# Altium project epsv2.PrjPCB
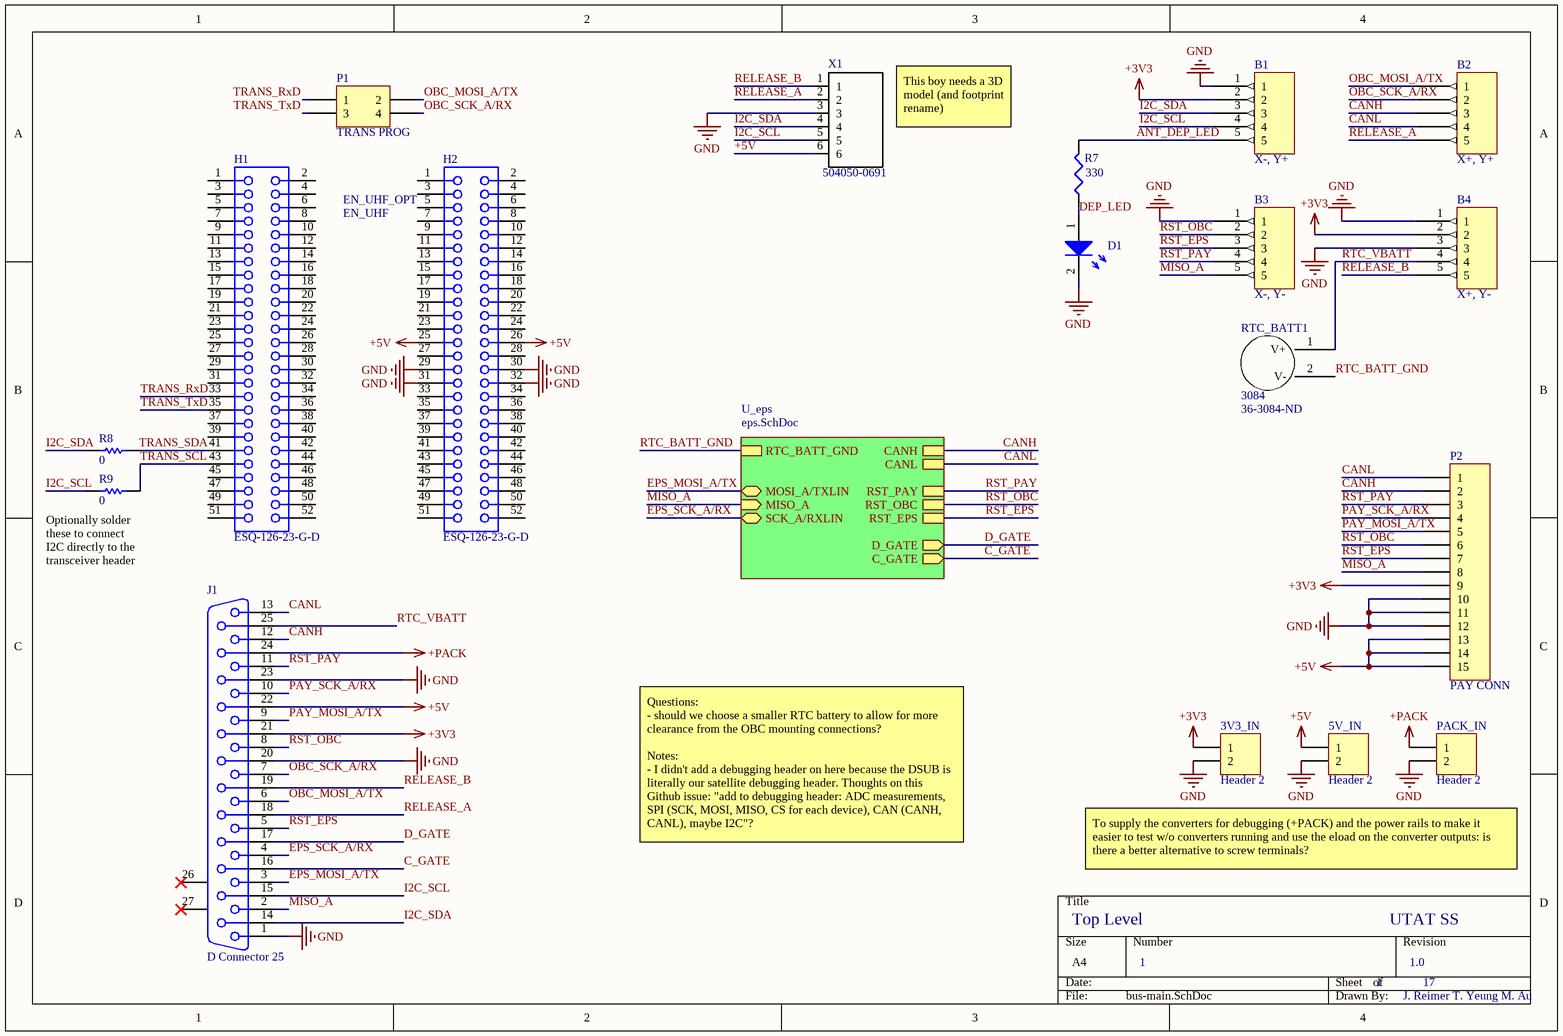
[diagram p0: bus-main.SchDoc]
9 sheets, 132 parts. Net scope: hierarchical (ports join the sheet entries above them; power ports are global).
Board file: eps.PcbDoc
Sheets:
  bus-main.SchDoc
  eps_6.0.SchDoc
    U_eps_digital = eps_digital.SchDoc
    U_eps_bb11 = eps_bb1.SchDoc
    U_eps_bb12 = eps_bb1.SchDoc
    U_eps_pv = eps_pv.SchDoc
    U_eps_bt11 = eps_bt1.SchDoc
    U_eps_bt12 = eps_bt1.SchDoc
    U_eps_batt = eps_batt.SchDoc
    Designator = bt_current_monitor.SchDoc
  eps_flash.SchDoc

## Sheet bus-main.SchDoc: Top Level
size A4; DrawnBy: J. Reimer T. Yeung M. Au; Organization: UTAT SS; DocumentNumber: 1; Revision: 1.0; SheetNumber: 1; SheetTotal: 17

### Parts
(Parts that share a designator on the sheet are numbered #1, #2 ... from top to bottom, then left to right.)
3V3_IN  Header 2  [CON2_SCREW_5.00MM_691102710002]
5V_IN  Header 2  [CON2_SCREW_5.00MM_691102710002]
B1  X-, Y+  [70AAJ-5-M0-ND]
B2  X+, Y+  [70AAJ-5-M0-ND]
B3  X-, Y-  [70AAJ-5-M0-ND]
B4  X+, Y-  [70AAJ-5-M0-ND]
D1#1  (no value)  [LED0603]
H1  ESQ-126-23-G-D  [SSW-126-01-G-D]
H2  ESQ-126-23-G-D  [SSW-126-01-G-D]
J1  D Connector 25  [Mini DSub Connector]
P1  TRANS PROG  [HDR2X2]
P2  PAY CONN  [DF13A-15P-1.25H(21)]
PACK_IN  Header 2  [CON2_SCREW_5.00MM_691102710002]
R7#1  330  [RES0402R]
R8  0  [1608[0603]]
R9#1  0  [1608[0603]]
RTC_BATT1  3084  Supplier Part Number 1: 36-3084-ND  [3084]
X1  504050-0691  [MOLEX_504050-0691]

### Sub-sheets
U_eps = eps.SchDoc (file not in this document): RST_PAY, RST_OBC, RST_EPS, SCK_A/RXLIN (bidir), MOSI_A/TXLIN (bidir), MISO_A (in), CANL, CANH, RTC_BATT_GND, D_GATE (out), C_GATE (out)

### Nets
+3V3: 3V3_IN.1 B1.2 B4.2 J1.21 P2.9
+5V: 5V_IN.1 H2.25 H2.26 J1.22 P2.13 P2.14 P2.15 X1.6
+PACK: J1.24 PACK_IN.1
GND: 3V3_IN.2 5V_IN.2 B1.1 B3.1 B4.1 B4.3 D1#1.2 H2.29 H2.30 H2.31 H2.32 J1.1 J1.20 J1.23 P2.10 P2.11 P2.12 PACK_IN.2 X1.3
ANT_DEP_LED: B1.5 R7#1.2
C_GATE: J1.16 ; sheet U_eps/C_GATE
CANH: B2.3 J1.12 P2.2 ; sheet U_eps/CANH
CANL: B2.4 J1.13 P2.1 ; sheet U_eps/CANL
D_GATE: J1.17 ; sheet U_eps/D_GATE
DEP_LED: D1#1.1 R7#1.1
EPS_MOSI_A/TX: J1.3 ; sheet U_eps/MOSI_A/TXLIN
EPS_SCK_A/RX: J1.4 ; sheet U_eps/SCK_A/RXLIN
I2C_SCL: B1.4 J1.15 R9#1.1 X1.5
I2C_SDA: B1.3 J1.14 R8.1 X1.4
MISO_A: B3.5 J1.2 P2.8 ; sheet U_eps/MISO_A
OBC_MOSI_A/TX: B2.1 J1.6 P1.2
OBC_SCK_A/RX: B2.2 J1.7 P1.4
PAY_MOSI_A/TX: J1.9 P2.5
PAY_SCK_A/RX: J1.10 P2.4
RELEASE_A: B2.5 J1.18 X1.2
RELEASE_B: B4.5 J1.19 X1.1
RST_EPS: B3.3 J1.5 P2.7 ; sheet U_eps/RST_EPS
RST_OBC: B3.2 J1.8 P2.6 ; sheet U_eps/RST_OBC
RST_PAY: B3.4 J1.11 P2.3 ; sheet U_eps/RST_PAY
RTC_BATT_GND: RTC_BATT1.2(V-) ; sheet U_eps/RTC_BATT_GND
RTC_VBATT: B4.4 J1.25 RTC_BATT1.1(V+)
TRANS_RxD: H1.33 P1.1
TRANS_SCL: H1.43 R9#1.2
TRANS_SDA: H1.41 R8.2
TRANS_TxD: H1.35 P1.3

Not connected (* = marked no-connect by the designer): H1 1 2 3 4 5 6 7 8 9 10 11 12 13 14 15 16 17 18 19 20 21 22 23 24 25 26 27 28 29 30 31 32 34 36 37 38 39 40 42 44 45 46 47 48 49 50 51 52; H2 1 2 3 4 5 6 7 8 9 10 11 12 13 14 15 16 17 18 19 20 21 22 23 24 27 28 33 34 35 36 37 38 39 40 41 42 43 44 45 46 47 48 49 50 51 52; J1 26(MH1)* 27(MH2)*

### Notes on the sheet
- This boy needs a 3D model (and footprint rename)
- EN_UHF
- EN_UHF_OPT
- (near R9#1) Optionally solder these to connect I2C directly to the transceiver header
- Questions:
  - should we choose a smaller RTC battery to allow for more clearance from the OBC mounting connections?
  Notes:
  - I didn't add a debugging header on here because the DSUB is literally our satellite debugging header. Thoughts on this Github issue: "add to debugging header: ADC measurements, SPI (SCK, MOSI, MISO, CS for each device), CAN (CANH, CANL), maybe I2C"?
- To supply the converters for debugging (+PACK) and the power rails to make it easier to test w/o converters running and use the eload on the converter outputs: is there a better alternative to screw terminals?

### Library data of the parts
3V3_IN 5V_IN PACK_IN = Header 2: Battery Header, 2-Pin; LatestRevisionDate: 17-Jul-2002; LatestRevisionNote: Re-released for DXP Platform.; Publisher: Altium Limited; Supplier 1: Digi-Key; Supplier Part Number 1: WM1351-ND
B1-B4 = 70AAJ-5-M0: Supplier 1: Digi-Key; Supplier Part Number 1: 70AAJ-5-M0-ND
D1#1 = LED: Just a generic LED
H1 H2 = ESQ-126-23-G-D: PC/104(TM) Elevated Socket Strip, Through-hole, Vertical, -55 to 125 degC, 2.54 mm Pitch, 52-Pin, Female, RoHS; Manufacturer: Samtec; Pitch: 2.54 mm; DatasheetVersion: F-214; PackageVersion: BZ, 9/1998; PackageReference: ESQ-126-23-X-D; PackageDescription: ESQ Strip ASM; Supplier 1: Newark; Supplier Part Number 1: 92P1348; Orientation: Vertical; RoHS: True; Temperature Range: -55 to 125 degC; Mounting Technology: Through-hole; PartNumber: ESQ-126-23-G-D; ComponentLink1Description: Manufacturer URL; ComponentLink1URL: http://www.samtec.com; ComponentLink2Description: Datasheet; ComponentLink2URL: http://www.samtec.com/documents/webfiles/pdf/ESQ_TH.PDF; ComponentLink3Description: Package Specification; ComponentLink3URL: http://www.samtec.com/documents/webfiles/cpdf/ESQ-1XX-XX-X-X-XXX-XX-X-XX-MKT.pdf
  H1: Supplier 2: Digi-Key; Supplier Part Number 2: ESQ-126-23-G-D-ND
J1 = D Connector 25: Receptacle Assembly, 25 Position, Right Angle; PackageDocument: U; Positions: 25; Published: 15-Jun-2001; LatestRevisionDate: 17-Jul-2002; LatestRevisionNote: Re-released for DXP Platform.; DatasheetDocument: 19-Mar-1999; PackageReference: 787202; Publisher: Altium Limited; Orientation: Right Angle; Gender: Receptacle; ComponentLink1Description: Mini-D25 - Molex, LLC 0836149012; ComponentLink1URL: https://www.digikey.ca/product-detail/en/molex-llc/0836149012/WM2144-ND/1867000; Supplier 1: Digi-Key; Supplier Part Number 1: WM2144-ND
P1 = Header 2X2: Header, 2-Pin, Dual row / For shorting transceiver pins together for testing/debugging; LatestRevisionDate: 17-Jul-2002; LatestRevisionNote: Re-released for DXP Platform.; Publisher: Altium Limited
P2 = Header 15: Header, 15-Pin; LatestRevisionDate: 17-Jul-2002; LatestRevisionNote: Re-released for DXP Platform.; Publisher: Altium Limited; Supplier 1: Digi-Key; Supplier Part Number 1: WM7632CT-ND
R7#1 = Res3: Resistor; Published: 8-Jun-2000; LatestRevisionDate: 29-May-2009; LatestRevisionNote: IPC-7351 Footprint Added.; PackageReference: J1-0603; Publisher: Altium Limited; PackageDescription: Chip Resistor; Value: 330
R8 R9#1 = Res1: (Optional) for connecting I2C to the transceiver; Published: 8-Jun-2000; LatestRevisionDate: 17-Jul-2002; LatestRevisionNote: Re-released for DXP Platform.; PackageReference: AXIAL-0.3; Publisher: Altium Limited; PackageDescription: Axial Device, Thru-Hole; 2 Leads; 0.3 in Pin Spacing; Value: 0
  R8: Supplier 1: Digi-Key; Supplier Part Number 1: 311-0.0GRDKR-ND
RTC_BATT1 = 3084: CR2330 Battery Holder; Manufacturer: Keystone Electronics; Number of Batteries: 2; Number of Cells: 1; Supplier 1: Digi-Key; Manufacturer Part Number: 3084; Stock 1: 658; Pricing 1: 1=0.62, 10=0.523, 50=0.4586, 250=0.39796, 500=0.391, 1000=0.34946, 2500=0.31916, 5000=0.29492 (USD); Mount: Surface Mount,PCB; Case/Package: SMD/SMT; Package Quantity: 100; Termination: SMD/SMT; Lead Free: Lead Free; REACH SVHC: No SVHC; ComponentLink1URL: http://media.digikey.com/pdf/Data%20Sheets/Keystone%20Electronics%20PDFs/Lithium_Coin_Cell_Retainers_SMT.pdf?src-supplier=Digi-Key; ComponentLink1Description: http://media.digikey.com/pdf/Data%20Sheets/Keystone%20Electronics%20PDFs/Lithium_Coin_Cell_Retainers_SMT.pdf?src-supplier=Digi-Key
X1 = 504050-0691: Wire-To-Board Connector, Pico-Lock 504050 Series, Surface Mount, Header, 6, 1.5 mm

## Sheet eps_6.0.SchDoc
size A; SheetNumber: 2
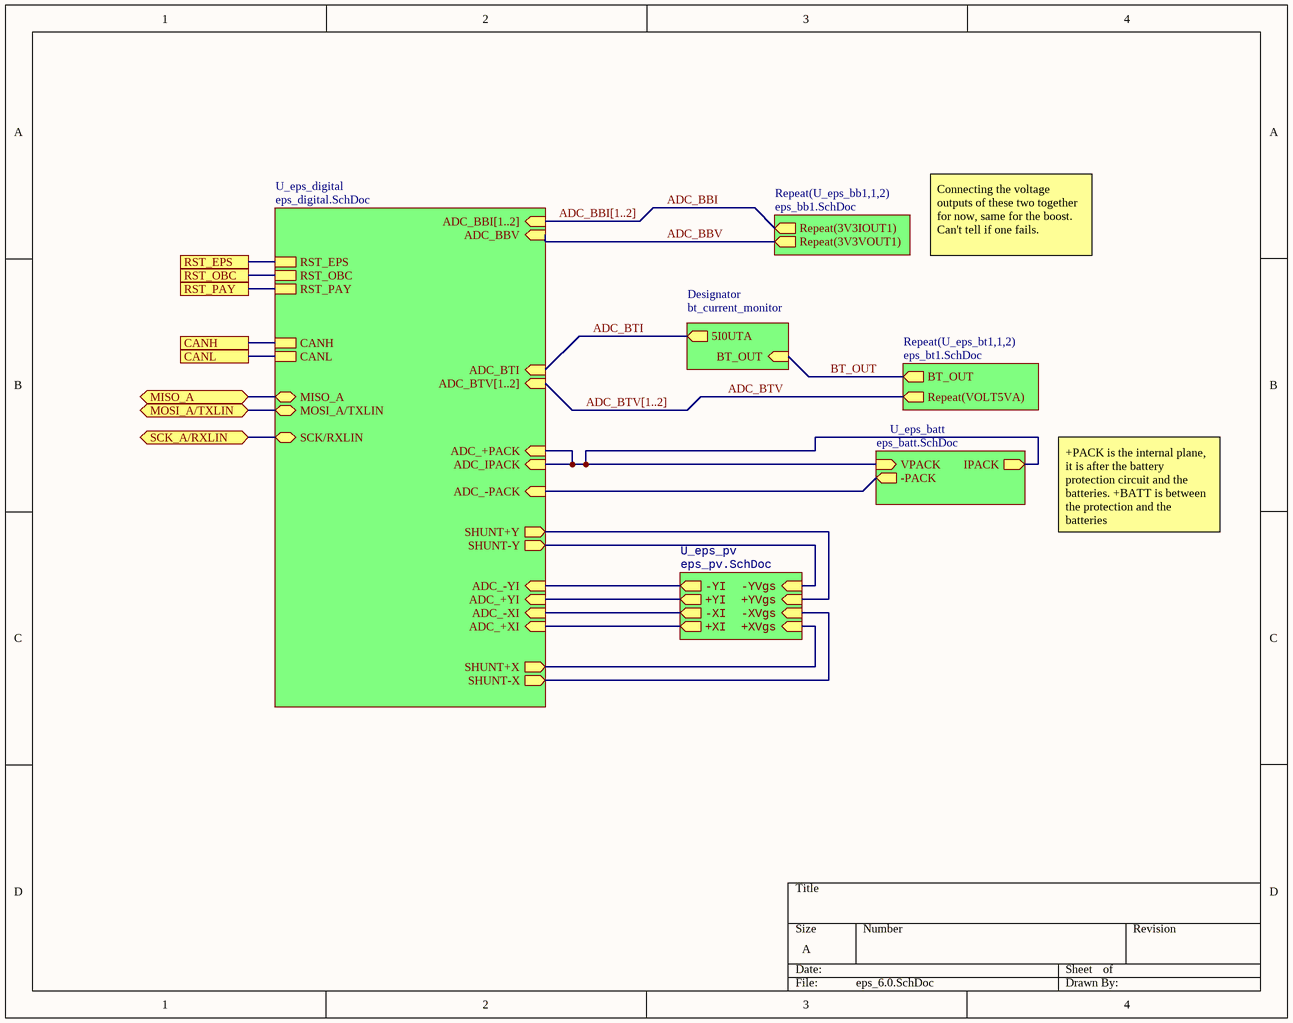
[diagram p1: eps_6.0.SchDoc]

### Sub-sheets
Designator = bt_current_monitor: 5I0UTA (out), BT_OUT (in)
Repeat(U_eps_bb1,1,2) = eps_bb1.SchDoc: Repeat(3V3IOUT1) (out), Repeat(3V3VOUT1) (out)
Repeat(U_eps_bt1,1,2) = eps_bt1.SchDoc: Repeat(VOLT5VA) (out), BT_OUT (out)
U_eps_batt = eps_batt.SchDoc: IPACK (out), VPACK (in), -PACK (out)
U_eps_digital = eps_digital.SchDoc: RST_EPS, RST_OBC, RST_PAY, CANH, CANL, MISO_A (bidir), MOSI_A/TXLIN (bidir), SCK/RXLIN (bidir), ADC_BTV[1..2] (in), ADC_BTI (in), ADC_-PACK (in), ADC_BBI[1..2] (in), ADC_+XI (in), ADC_-XI (in), ADC_+YI (in), ADC_+PACK (in), ADC_-YI (in), SHUNT-Y (out), SHUNT+Y (out), ADC_BBV (in), SHUNT-X (out), SHUNT+X (out), ADC_IPACK (in)
U_eps_pv = eps_pv.SchDoc: +YI (out), -YI (out), -YVgs (in), +XI (out), +YVgs (in), +XVgs (in), -XVgs (in), -XI (out)

### Ports
CANH, CANL, MISO_A (bidir), MOSI_A/TXLIN (bidir), RST_EPS, RST_OBC, RST_PAY, SCK_A/RXLIN (bidir)

### Nets
+XI: sheet U_eps_digital/ADC_+XI, sheet U_eps_pv/+XI
+XVgs: sheet U_eps_digital/SHUNT+X, sheet U_eps_pv/+XVgs
+YI: sheet U_eps_digital/ADC_+YI, sheet U_eps_pv/+YI
+YVgs: sheet U_eps_digital/SHUNT+Y, sheet U_eps_pv/+YVgs
-XI: sheet U_eps_digital/ADC_-XI, sheet U_eps_pv/-XI
-XVgs: sheet U_eps_digital/SHUNT-X, sheet U_eps_pv/-XVgs
-YI: sheet U_eps_digital/ADC_-YI, sheet U_eps_pv/-YI
-YVgs: sheet U_eps_digital/SHUNT-Y, sheet U_eps_pv/-YVgs
ADC_BBI: sheet Repeat(U_eps_bb1,1,2)/Repeat(3V3IOUT1)
ADC_BBV: sheet U_eps_digital/ADC_BBV, sheet Repeat(U_eps_bb1,1,2)/Repeat(3V3VOUT1)
ADC_BTI: sheet U_eps_digital/ADC_BTI, sheet Designator/5I0UTA
ADC_BTV: sheet Repeat(U_eps_bt1,1,2)/Repeat(VOLT5VA)
BT_OUT: sheet Repeat(U_eps_bt1,1,2)/BT_OUT, sheet Designator/BT_OUT
CANH: port CANH, sheet U_eps_digital/CANH
CANL: port CANL, sheet U_eps_digital/CANL
IPACK: sheet U_eps_digital/ADC_+PACK, sheet U_eps_digital/ADC_IPACK, sheet U_eps_batt/IPACK, sheet U_eps_batt/VPACK
MISO_A: port MISO_A, sheet U_eps_digital/MISO_A
MOSI_A/TXLIN: port MOSI_A/TXLIN, sheet U_eps_digital/MOSI_A/TXLIN
RS_OBC: port RST_OBC, sheet U_eps_digital/RST_OBC
RS_PAY: port RST_PAY, sheet U_eps_digital/RST_PAY
RST_EPS: port RST_EPS, sheet U_eps_digital/RST_EPS
SCK_A/RXLIN: port SCK_A/RXLIN, sheet U_eps_digital/SCK/RXLIN
(unnamed): sheet U_eps_digital/ADC_-PACK, sheet U_eps_batt/-PACK

### Buses and harness runs
bus ADC_BBI[1..2] = sheet U_eps_digital/ADC_BBI[1..2]
bus ADC_BTV[1..2] = sheet U_eps_digital/ADC_BTV[1..2]

### Notes on the sheet
- Connecting the voltage outputs of these two together for now, same for the boost. Can't tell if one fails.
- +PACK is the internal plane, it is after the battery protection circuit and the batteries. +BATT is between the protection and the batteries

## Sheet eps_digital.SchDoc: Digital Top Level
size A4; DrawnBy: J. Reimer T. Yeung M. Au; Organization: UTAT SS; DocumentNumber: 7; Revision: 2.0; SheetNumber: 7; SheetTotal: 17
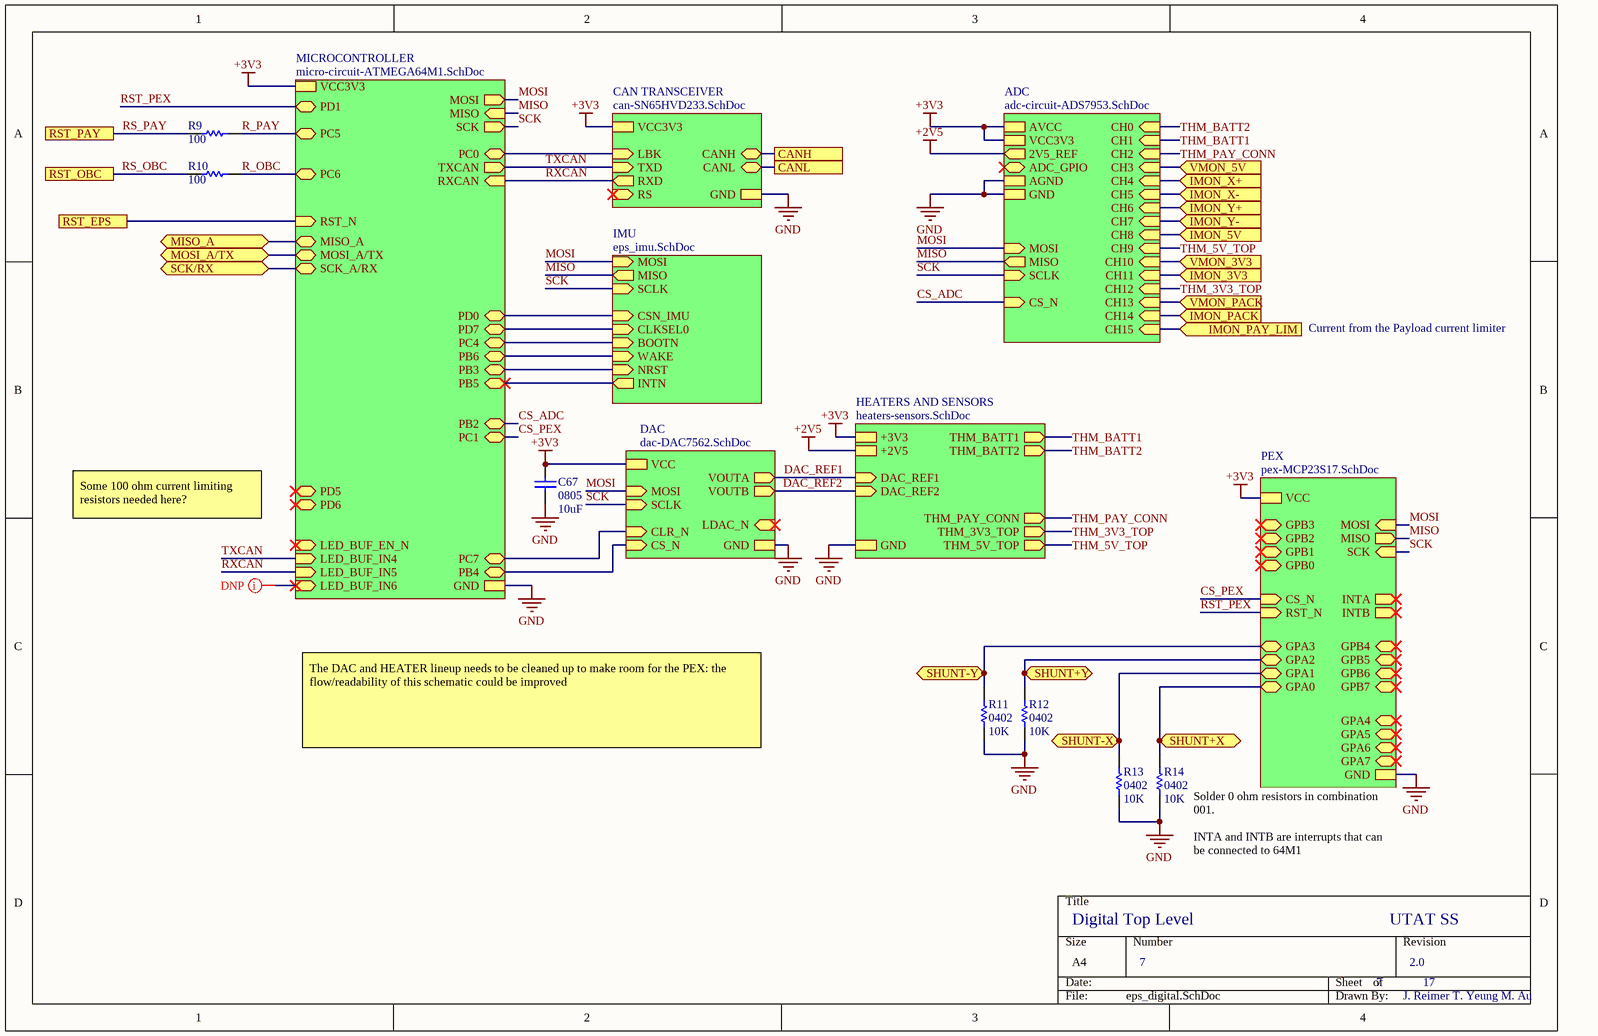
[diagram p2: eps_digital.SchDoc]

### Parts
(Parts that share a designator on the sheet are numbered #1, #2 ... from top to bottom, then left to right.)
C67  0805  value 10uF  [CAP0805R]
R9#2  value 100  [RES0402R]  (hidden comment: 0402)
R10  value 100  [RES0402R]  (hidden comment: 0402)
R11  0402  value 10K  [RES0402R]
R12  0402  value 10K  [RES0402R]
R13  0402  value 10K  [RES0402R]
R14  0402  value 10K  [RES0402R]

### Sub-sheets
ADC = adc-circuit-ADS7953.SchDoc (file not in this document): CH10 (in), CH11 (in), CH9 (in), CH5 (in), CH6 (in), CH7 (in), CH3 (in), CH2 (in), CH8 (in), CH4 (in), CH1 (in), CH0 (in), CS_N (in), AVCC, ADC_GPIO (bidir), 2V5_REF (out), VCC3V3, AGND, GND, MISO (out), MOSI (in), SCLK (in), CH12 (in), CH14 (in), CH13 (in), CH15 (in)
CAN TRANSCEIVER = can-SN65HVD233.SchDoc (file not in this document): RXD (out), TXD (in), LBK (in), CANL (bidir), CANH (bidir), RS (in), VCC3V3, GND
DAC = dac-DAC7562.SchDoc (file not in this document): MOSI (in), CLR_N (in), SCLK (in), CS_N (in), VOUTB (out), VOUTA (out), VCC, GND, LDAC_N (in)
HEATERS AND SENSORS = heaters-sensors.SchDoc (file not in this document): +2V5, DAC_REF1 (in), GND, DAC_REF2 (in), +3V3, THM_BATT1 (out), THM_BATT2 (out), THM_3V3_TOP (out), THM_5V_TOP (out), THM_PAY_CONN (out)
IMU = eps_imu.SchDoc (file not in this document): NRST (in), CSN_IMU (in), MISO (out), CLKSEL0 (in), WAKE (in), BOOTN (in), INTN (out), SCLK (in), MOSI (in)
MICROCONTROLLER = micro-circuit-ATMEGA64M1.SchDoc (file not in this document): MOSI_A/TX (bidir), TXCAN (out), RXCAN (in), SCK_A/RX (bidir), PC6 (bidir), PC5 (bidir), PD1 (bidir), PB5 (bidir), PC1 (bidir), PB2 (bidir), RST_N (in), PC0 (bidir), MISO_A (bidir), PB4 (bidir), PD7 (bidir), PB3 (bidir), VCC3V3, PB6 (bidir), PD6 (bidir), GND, LED_BUF_IN6 (in), LED_BUF_IN5 (in), LED_BUF_IN4 (in), LED_BUF_EN_N (in), PD0 (bidir), PD5 (bidir), PC4 (bidir), PC7 (bidir), MISO (in), SCK (out), MOSI (out)
PEX = pex-MCP23S17.SchDoc (file not in this document): GPB0 (bidir), GPB1 (bidir), GPB2 (bidir), GPB3 (bidir), GPA1 (bidir), GPA2 (bidir), GPA0 (bidir), GPA3 (bidir), CS_N (in), RST_N (in), MISO (out), MOSI (in), SCK (in), GND, INTB (out), INTA (out), VCC, GPB6 (bidir), GPA6 (bidir), GPB5 (bidir), GPB7 (bidir), GPA4 (bidir), GPA5 (bidir), GPA7 (bidir), GPB4 (bidir)

### Ports
CANH, CANL, IMON_3V3 (in), IMON_5V (in), IMON_PACK (in), IMON_PAY_LIM (in), IMON_X+ (in), IMON_X- (in), IMON_Y+ (in), IMON_Y- (in), MISO_A (bidir), MOSI_A/TX (bidir), RST_EPS, RST_OBC, RST_PAY, SCK/RX (bidir), SHUNT+X (bidir), SHUNT+Y (bidir), SHUNT-X (bidir), SHUNT-Y (bidir), VMON_3V3 (in), VMON_5V (in), VMON_PACK (in)

### Nets
+2V5: sheet ADC/2V5_REF, sheet HEATERS AND SENSORS/+2V5
+3V3: C67.2 ; sheet MICROCONTROLLER/VCC3V3, sheet DAC/VCC, sheet ADC/AVCC, sheet ADC/VCC3V3, sheet HEATERS AND SENSORS/+3V3, sheet CAN TRANSCEIVER/VCC3V3, sheet PEX/VCC
GND: C67.1 R11.1 R12.1 R13.1 R14.1 ; sheet MICROCONTROLLER/GND, sheet DAC/GND, sheet ADC/AGND, sheet ADC/GND, sheet HEATERS AND SENSORS/GND, sheet CAN TRANSCEIVER/GND, sheet PEX/GND
+XVgs: R14.2 ; port SHUNT+X, sheet PEX/GPA0
+YVgs: R12.2 ; port SHUNT+Y, sheet PEX/GPA2
-XVgs: R13.2 ; port SHUNT-X, sheet PEX/GPA1
-YVgs: R11.2 ; port SHUNT-Y, sheet PEX/GPA3
CANH: port CANH, sheet CAN TRANSCEIVER/CANH
CANL: port CANL, sheet CAN TRANSCEIVER/CANL
CS_ADC: sheet MICROCONTROLLER/PB2, sheet ADC/CS_N
CS_PEX: sheet MICROCONTROLLER/PC1, sheet PEX/CS_N
DAC_REF1: sheet DAC/VOUTA, sheet HEATERS AND SENSORS/DAC_REF1
DAC_REF2: sheet DAC/VOUTB, sheet HEATERS AND SENSORS/DAC_REF2
IMON_3V3: port IMON_3V3, sheet ADC/CH11
IMON_5V: port IMON_5V, sheet ADC/CH8
IMON_PACK: port IMON_PACK, sheet ADC/CH14
IMON_PAY_LIM: port IMON_PAY_LIM, sheet ADC/CH15
IMON_X+: port IMON_X+, sheet ADC/CH4
IMON_X-: port IMON_X-, sheet ADC/CH5
IMON_Y+: port IMON_Y+, sheet ADC/CH6
IMON_Y-: port IMON_Y-, sheet ADC/CH7
MISO: sheet MICROCONTROLLER/MISO, sheet ADC/MISO, sheet IMU/MISO, sheet PEX/MISO
MISO_A: port MISO_A, sheet MICROCONTROLLER/MISO_A
MOSI: sheet MICROCONTROLLER/MOSI, sheet DAC/MOSI, sheet ADC/MOSI, sheet IMU/MOSI, sheet PEX/MOSI
MOSI_A/TX: port MOSI_A/TX, sheet MICROCONTROLLER/MOSI_A/TX
R_OBC: R10.2 ; sheet MICROCONTROLLER/PC6
R_PAY: R9#2.2 ; sheet MICROCONTROLLER/PC5
RS_OBC: R10.1 ; port RST_OBC
RS_PAY: R9#2.1 ; port RST_PAY
RST_EPS: port RST_EPS, sheet MICROCONTROLLER/RST_N
RST_PEX: sheet MICROCONTROLLER/PD1, sheet PEX/RST_N
RXCAN: sheet MICROCONTROLLER/RXCAN, sheet MICROCONTROLLER/LED_BUF_IN5, sheet CAN TRANSCEIVER/RXD
SCK: sheet MICROCONTROLLER/SCK, sheet DAC/SCLK, sheet ADC/SCLK, sheet IMU/SCLK, sheet PEX/SCK
SCK/RX: port SCK/RX, sheet MICROCONTROLLER/SCK_A/RX
THM_3V3_TOP: sheet ADC/CH12, sheet HEATERS AND SENSORS/THM_3V3_TOP
THM_5V_TOP: sheet ADC/CH9, sheet HEATERS AND SENSORS/THM_5V_TOP
THM_BATT1: sheet ADC/CH1, sheet HEATERS AND SENSORS/THM_BATT1
THM_BATT2: sheet ADC/CH0, sheet HEATERS AND SENSORS/THM_BATT2
THM_PAY_CONN: sheet ADC/CH2, sheet HEATERS AND SENSORS/THM_PAY_CONN
TXCAN: sheet MICROCONTROLLER/TXCAN, sheet MICROCONTROLLER/LED_BUF_IN4, sheet CAN TRANSCEIVER/TXD
VMON_3V3: port VMON_3V3, sheet ADC/CH10
VMON_5V: port VMON_5V, sheet ADC/CH3
VMON_PACK: port VMON_PACK, sheet ADC/CH13
(unnamed): sheet MICROCONTROLLER/PB5, sheet IMU/INTN
(unnamed): sheet MICROCONTROLLER/PC0, sheet CAN TRANSCEIVER/LBK
(unnamed): sheet MICROCONTROLLER/PB4, sheet DAC/CS_N
(unnamed): sheet MICROCONTROLLER/PD7, sheet IMU/CLKSEL0
(unnamed): sheet MICROCONTROLLER/PB3, sheet IMU/NRST
(unnamed): sheet MICROCONTROLLER/PB6, sheet IMU/WAKE
(unnamed): sheet MICROCONTROLLER/PD0, sheet IMU/CSN_IMU
(unnamed): sheet MICROCONTROLLER/PC4, sheet IMU/BOOTN
(unnamed): sheet MICROCONTROLLER/PC7, sheet DAC/CLR_N

### Layout directives
mark named DNP: (no net found under the mark)

### Notes on the sheet
- Current from the Payload current limiter
- Some 100 ohm current limiting resistors needed here?
- The DAC and HEATER lineup needs to be cleaned up to make room for the PEX: the flow/readability of this schematic could be improved
- (near R14) Solder 0 ohm resistors in combination 001.
  INTA and INTB are interrupts that can be connected to 64M1

### Library data of the parts
C67 = CAP0805: 0805 capacitor
R9#2 R10-R14 = RES0402: 0402 resistor

## Sheet eps_bb1.SchDoc
size A4; SheetNumber: 7; SheetTotal: 19
Used 2 times, as channels U_eps_bb11, U_eps_bb12. Parts and nets are listed once, with the designators drawn on the sheet.
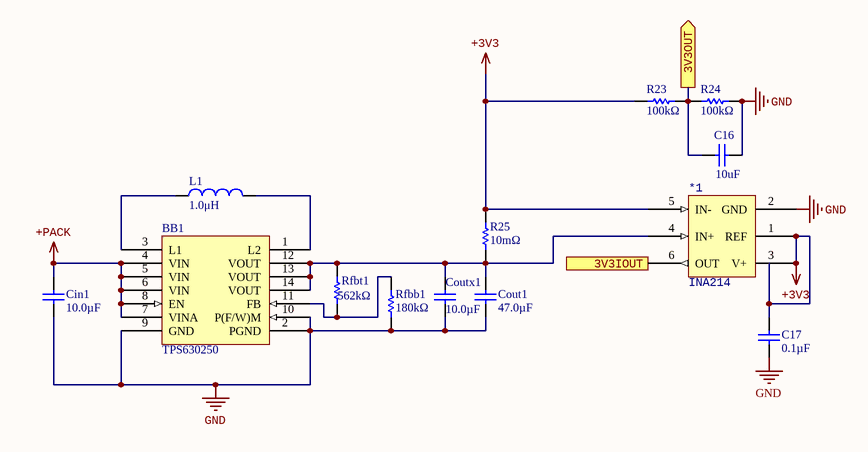
[diagram p3: eps_bb1.SchDoc]

### Parts
*1  INA214  [SOT65P210X110-6N]
BB1  TPS630250  [RNC0014A]
C16  10uF  [1608[0603]]
C17  0.1µF  [1608[0603]]
Cin1  10.0µF  [1608[0603]]
Cout1  47.0µF  [1608[0603]]
Coutx1  10.0µF  [1608[0603]]
L1  1.0μH  [1608[0603]]
R23  100kΩ  [1608[0603]]
R24  100kΩ  [1608[0603]]
R25  10mΩ  [1608[0603]]
Rfbb1  180kΩ  [1608[0603]]
Rfbt1  562kΩ  [1608[0603]]

### Ports
3V3IOUT (out), 3V3OUT (out)

### Nets
+3V3: *1.1(REF) *1.3(V+) *1.5(IN-) C17.2 R23.1 R25.2
+PACK: BB1.4(VIN) BB1.5(VIN) BB1.6(VIN) BB1.7(VINA) BB1.8(EN) Cin1.2
GND: *1.2(GND) BB1.2(PGND) BB1.9(GND) BB1.10(P(F/W)M) C16.1 C17.1 Cin1.1 Cout1.1 Coutx1.1 R24.2 Rfbb1.1
3V3IOUT: *1.6(OUT) ; port 3V3IOUT
3V3OUT: C16.2 R23.2 R24.1 ; port 3V3OUT
Net*1_4: *1.4(IN+) BB1.12(VOUT) BB1.13(VOUT) BB1.14(VOUT) Cout1.2 Coutx1.2 R25.1 Rfbt1.1
NetBB1_1: BB1.1(L2) L1.2
NetBB1_3: BB1.3(L1) L1.1
NetBB1_11: BB1.11(FB) Rfbb1.2 Rfbt1.2

### Channels
U_eps_bb11: designators end in _U_eps_bb11; ports 3V3IOUT=3V3IOUT_U_eps_bb11 3V3OUT=3V3OUT_U_eps_bb11
U_eps_bb12: designators end in _U_eps_bb12; ports 3V3IOUT=3V3IOUT_U_eps_bb12 3V3OUT=3V3OUT_U_eps_bb12

### Library data of the parts
*1 = INA214: Current monitor
BB1 = TPS630250: Buck-boost converter; Supplier 1: Digi-Key; Supplier Part Number 1: 296-42036-6-ND
C16 Cin1 Cout1 Coutx1 = Cap: Capacitor; Published: 8-Jun-2000; LatestRevisionDate: 17-Jul-2002; LatestRevisionNote: Re-released for DXP Platform.; PackageReference: RAD-0.3; Publisher: Altium Limited; PackageDescription: Radial Cap, Thru-Hole; 2 Leads; 0.3 in Pin Spacing
  C16: Value: 10uF
  Cin1 Coutx1: Value: 10.0µF
  Cout1: Value: 47.0µF
C17 = Cap Semi: Capacitor (Semiconductor SIM Model); Published: 8-Jun-2000; LatestRevisionDate: 29-May-2009; LatestRevisionNote: IPC-7351 Footprint Added.; PackageReference: C1206; Publisher: Altium Limited; PackageDescription: Chip Capacitor; Value: 0.1µF
L1 = Inductor: Code_IEC: 1005; Published: 8-Jun-2000; LatestRevisionDate: 29-May-2009; LatestRevisionNote: IPC-7351 Footprint Added.; PackageReference: 0402-A; Publisher: Altium Limited; PackageDescription: Chip Inductor; Code_JEITA: 0402; Value: 1.0μH
R23-R25 Rfbb1 Rfbt1 = Res1: Resistor; Published: 8-Jun-2000; LatestRevisionDate: 17-Jul-2002; LatestRevisionNote: Re-released for DXP Platform.; PackageReference: AXIAL-0.3; Publisher: Altium Limited; PackageDescription: Axial Device, Thru-Hole; 2 Leads; 0.3 in Pin Spacing
  R23 R24: Value: 100kΩ
  R25: Value: 10mΩ
  Rfbb1: Value: 180kΩ
  Rfbt1: Value: 562kΩ

## Sheet eps_pv.SchDoc: Photovoltaics
size A4; DrawnBy: J. Reimer T. Yeung M. Au; Organization: UTAT SS; DocumentNumber: 6; Revision: 2.0; SheetNumber: 6; SheetTotal: 17
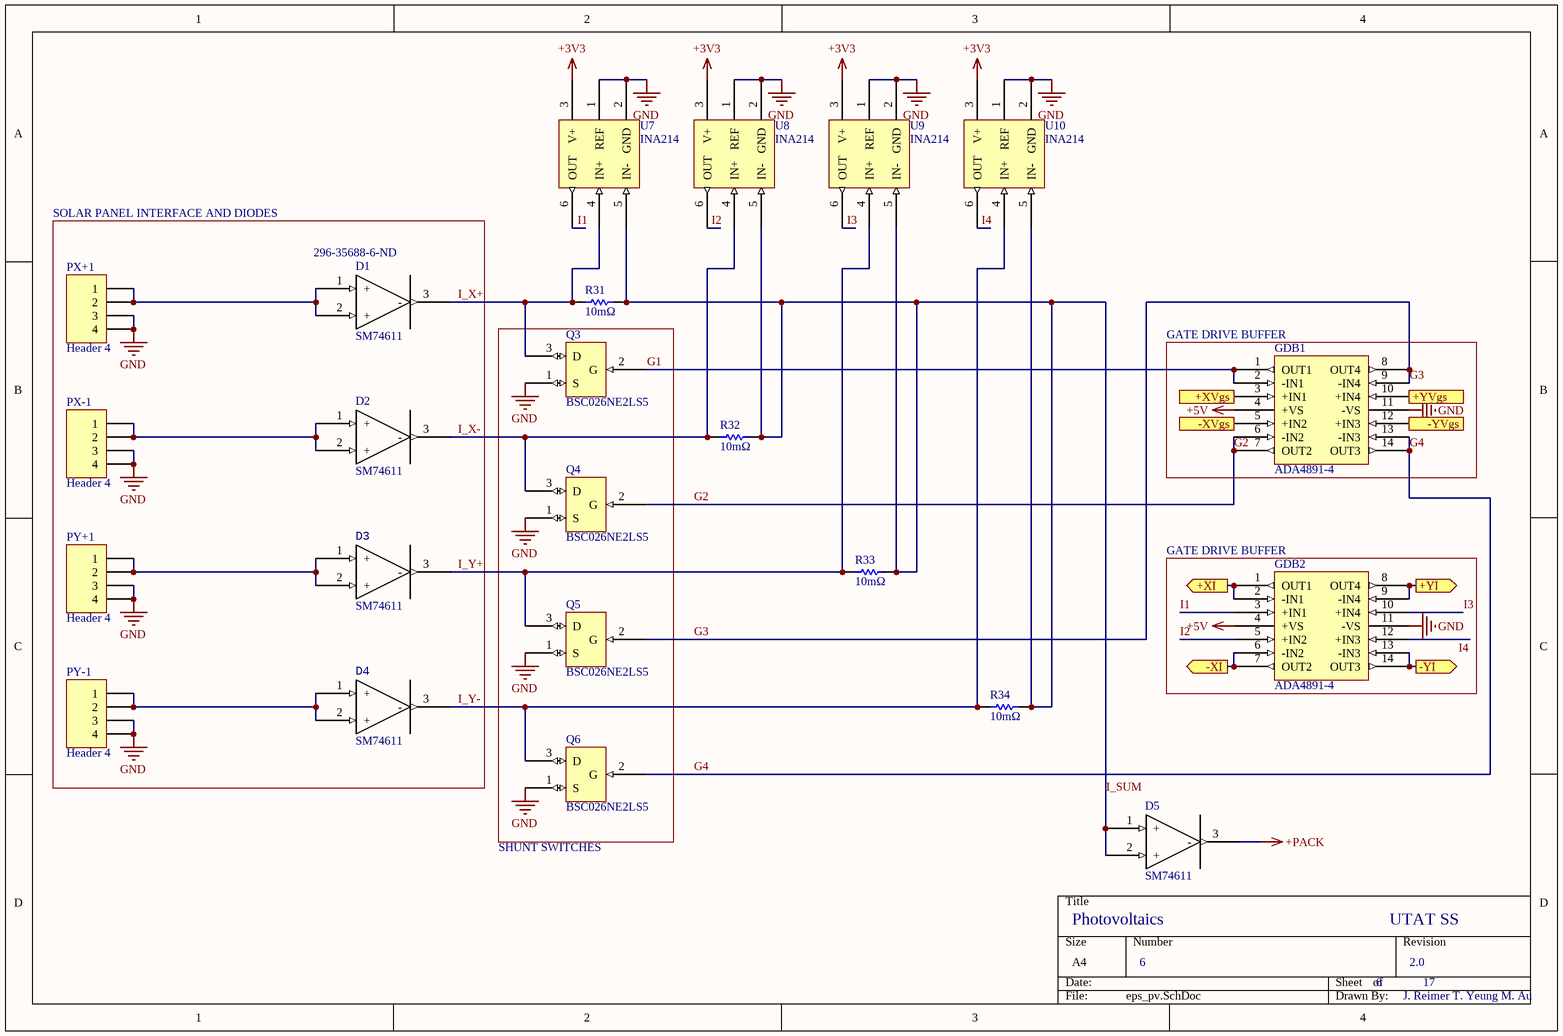
[diagram p4: eps_pv.SchDoc]

### Parts
(Parts that share a designator on the sheet are numbered #1, #2 ... from top to bottom, then left to right.)
D1#2  SM74611  Supplier Part Number 1: 296-35688-6-ND  [TO254P1435X464-3N]
D2  SM74611  [TO254P1435X464-3N]
D3  SM74611  [TO254P1435X464-3N]
D4  SM74611  [TO254P1435X464-3N]
D5  SM74611  [TO254P1435X464-3N]
GDB1  ADA4891-4  [SOIC127P600X175-14N]
GDB2  ADA4891-4  [SOIC127P600X175-14N]
PX+1  Header 4  [WM7622CT-ND]
PX-1  Header 4  [WM7622CT-ND]
PY+1  Header 4  [WM7622CT-ND]
PY-1  Header 4  [WM7622CT-ND]
Q3  BSC026NE2LS5  [INF-PG-TDSON-8-1_V]
Q4  BSC026NE2LS5  [INF-PG-TDSON-8-1_V]
Q5  BSC026NE2LS5  [INF-PG-TDSON-8-1_V]
Q6  BSC026NE2LS5  [INF-PG-TDSON-8-1_V]
R31  10mΩ  [C1206]
R32  10mΩ  [C1206]
R33  10mΩ  [C1206]
R34  10mΩ  [C1206]
U7  INA214  [SOT65P210X110-6N]
U8#1  INA214  [SOT65P210X110-6N]
U9  INA214  [SOT65P210X110-6N]
U10  INA214  [SOT65P210X110-6N]

### Blocks framed on the sheet
SOLAR PANEL INTERFACE AND DIODES: D1#2 D2-D4 PX+1 PX-1 PY+1 PY-1
GATE DRIVE BUFFER: GDB1
GATE DRIVE BUFFER: GDB2

### Ports
+XI (out), +XVgs (in), +YI (out), +YVgs (in), -XI (out), -XVgs (in), -YI (out), -YVgs (in)

### Nets
+3V3: U7.3(V+) U8#1.3(V+) U9.3(V+) U10.3(V+)
+5V: GDB1.4(+VS) GDB2.4(+VS)
+PACK: D5.3(-)
GND: GDB1.11(-VS) GDB2.11(-VS) PX+1.3 PX+1.4 PX-1.3 PX-1.4 PY+1.3 PY+1.4 PY-1.3 PY-1.4 Q3.1(S) Q4.1(S) Q5.1(S) Q6.1(S) U7.1(REF) U7.2(GND) U8#1.1(REF) U8#1.2(GND) U9.1(REF) U9.2(GND) U10.1(REF) U10.2(GND)
+XI: GDB2.1(OUT1) GDB2.2(-IN1) ; port +XI
+XVgs: GDB1.3(+IN1) ; port +XVgs
+YI: GDB2.8(OUT4) GDB2.9(-IN4) ; port +YI
+YVgs: GDB1.10(+IN4) ; port +YVgs
-XI: GDB2.6(-IN2) GDB2.7(OUT2) ; port -XI
-XVgs: GDB1.5(+IN2) ; port -XVgs
-YI: GDB2.13(-IN3) GDB2.14(OUT3) ; port -YI
-YVgs: GDB1.12(+IN3) ; port -YVgs
G1: GDB1.1(OUT1) GDB1.2(-IN1) Q3.2(G)
G2: GDB1.6(-IN2) GDB1.7(OUT2) Q4.2(G)
G3: GDB1.8(OUT4) GDB1.9(-IN4) Q5.2(G)
G4: GDB1.13(-IN3) GDB1.14(OUT3) Q6.2(G)
I1: GDB2.3(+IN1) U7.6(OUT)
I2: GDB2.5(+IN2) U8#1.6(OUT)
I3: GDB2.10(+IN4) U9.6(OUT)
I4: GDB2.12(+IN3) U10.6(OUT)
I_SUM: D5.1(+) D5.2(+) R31.2 R32.2 R33.2 R34.2 U7.5(IN-) U8#1.5(IN-) U9.5(IN-) U10.5(IN-)
I_X+: D1#2.3(-) Q3.3(D) R31.1 U7.4(IN+)
I_X-: D2.3(-) Q4.3(D) R32.1 U8#1.4(IN+)
I_Y+: D3.3(-) Q5.3(D) R33.1 U9.4(IN+)
I_Y-: D4.3(-) Q6.3(D) R34.1 U10.4(IN+)
NetD1#2_1: D1#2.1(+) D1#2.2(+) PX+1.1 PX+1.2
NetD2_1: D2.1(+) D2.2(+) PX-1.1 PX-1.2
NetD3_1: D3.1(+) D3.2(+) PY+1.1 PY+1.2
NetD4_1: D4.1(+) D4.2(+) PY-1.1 PY-1.2

### Notes on the sheet
- SHUNT SWITCHES

### Library data of the parts
D1#2 D2-D5 = SM74611: PV Diode
  D1#2: Supplier 1: Digi-Key
GDB1 GDB2 = ADA4891-4: Op-amps; Supplier 1: Digi-Key; Supplier Part Number 1: ADA4891-4ARZ-R7DKR-ND
PX+1 PX-1 PY+1 PY-1 = Header 4: Header, 4-Pin; LatestRevisionDate: 17-Jul-2002; LatestRevisionNote: Re-released for DXP Platform.; Publisher: Altium Limited
  PX+1 PX-1: Supplier 1: Digi-Key; Supplier Part Number 1: WM7622CT-ND
Q3-Q6 = BSC026NE2LS5: MOSFET
  Q3: Supplier 1: Digi-Key; Supplier Part Number 1: BSC026NE2LS5ATMA1DKR-ND
R31-R34 = Res1: Resistor; Published: 8-Jun-2000; LatestRevisionDate: 17-Jul-2002; LatestRevisionNote: Re-released for DXP Platform.; PackageReference: AXIAL-0.3; Publisher: Altium Limited; PackageDescription: Axial Device, Thru-Hole; 2 Leads; 0.3 in Pin Spacing; Value: 10mΩ
  R31: Supplier 1: Digi-Key; Supplier Part Number 1: P0.01BVDKR-ND
U7 U8#1 U9 U10 = INA214: Current monitor; Supplier 1: Digi-Key; Supplier Part Number 1: 296-38956-6-ND

## Sheet eps_bt1.SchDoc
size A; SheetNumber: 6; SheetTotal: 19
Used 2 times, as channels U_eps_bt11, U_eps_bt12. Parts and nets are listed once, with the designators drawn on the sheet.
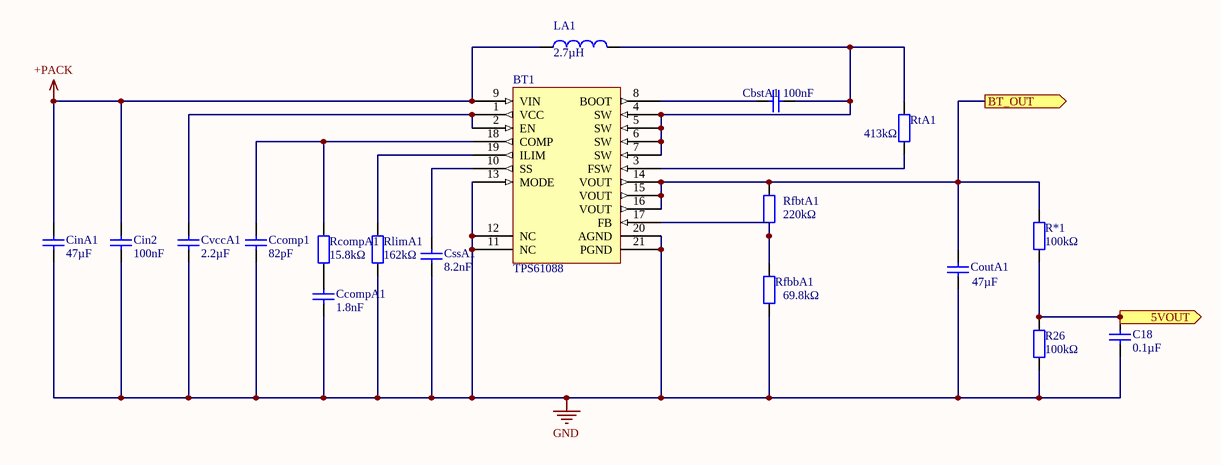
[diagram p5: eps_bt1.SchDoc]

### Parts
BT1  TPS61088  [QFN50P450X350X100-21N]
C18  0.1µF  [1608[0603]]
CbstA1  100nF  [1608[0603]]
Ccomp1  82pF  [1608[0603]]
CcompA1  1.8nF  [1608[0603]]
Cin2  100nF  [1608[0603]]
CinA1  47µF  [1608[0603]]
CoutA1  47µF  [1608[0603]]
CssA1  8.2nF  [1608[0603]]
CvccA1  2.2µF  [1608[0603]]
LA1  2.7µH  [1608[0603]]
R26  100kΩ  [1608[0603]]
R*1  100kΩ  [1608[0603]]
RcompA1  15.8kΩ  [1608[0603]]
RfbbA1  69.8kΩ  [1608[0603]]
RfbtA1  220kΩ  [1608[0603]]
RlimA1  162kΩ  [1608[0603]]
RtA1  413kΩ  [1608[0603]]

### Ports
5VOUT (out), BT_OUT (out)

### Nets
+PACK: BT1.9(VIN) Cin2.2 CinA1.2 LA1.1
GND: BT1.11(NC) BT1.12(NC) BT1.13(MODE) BT1.20(AGND) BT1.21(PGND) C18.2 Ccomp1.1 CcompA1.1 Cin2.1 CinA1.1 CoutA1.1 CssA1.1 CvccA1.1 R26.1 RfbbA1.1 RlimA1.1
5VOUT: C18.1 R26.2 R*1.1 ; port 5VOUT
BT_OUT: BT1.14(VOUT) BT1.15(VOUT) BT1.16(VOUT) CoutA1.2 R*1.2 RfbtA1.2 ; port BT_OUT
NetBT1_1: BT1.1(VCC) BT1.2(EN) CvccA1.2
NetBT1_3: BT1.3(FSW) RtA1.2
NetBT1_4: BT1.4(SW) BT1.5(SW) BT1.6(SW) BT1.7(SW) CbstA1.1 LA1.2 RtA1.1
NetBT1_8: BT1.8(BOOT) CbstA1.2
NetBT1_10: BT1.10(SS) CssA1.2
NetBT1_17: BT1.17(FB) RfbbA1.2 RfbtA1.1
NetBT1_18: BT1.18(COMP) Ccomp1.2 RcompA1.2
NetBT1_19: BT1.19(ILIM) RlimA1.2
NetCcompA1_2: CcompA1.2 RcompA1.1

### Channels
U_eps_bt11: designators end in _U_eps_bt11; ports 5VOUT=5VOUT_U_eps_bt11 BT_OUT=BT_OUT
U_eps_bt12: designators end in _U_eps_bt12; ports 5VOUT=5VOUT_U_eps_bt12 BT_OUT=BT_OUT

### Library data of the parts
BT1 = TPS61088: Boost converter
C18 CbstA1 Ccomp1 CcompA1 Cin2 CinA1 CoutA1 CssA1 CvccA1 = Cap: Capacitor; Published: 8-Jun-2000; LatestRevisionDate: 17-Jul-2002; LatestRevisionNote: Re-released for DXP Platform.; PackageReference: RAD-0.3; Publisher: Altium Limited; PackageDescription: Radial Cap, Thru-Hole; 2 Leads; 0.3 in Pin Spacing
  C18: Value: 0.1µF
  CbstA1 Cin2: Value: 100nF
  Ccomp1: Value: 82pF
  CcompA1: Value: 1.8nF
  CinA1 CoutA1: Value: 47µF
  CssA1: Value: 8.2nF
  CvccA1: Value: 2.2µF
LA1 = Inductor: Code_IEC: 1005; Published: 8-Jun-2000; LatestRevisionDate: 29-May-2009; LatestRevisionNote: IPC-7351 Footprint Added.; PackageReference: 0402-A; Publisher: Altium Limited; PackageDescription: Chip Inductor; Code_JEITA: 0402; Value: 2.7µH
R26 R*1 RcompA1 RfbbA1 RfbtA1 RlimA1 RtA1 = Res2: Resistor; Published: 8-Jun-2000; LatestRevisionDate: 17-Jul-2002; LatestRevisionNote: Re-released for DXP Platform.; PackageReference: AXIAL-0.4; Publisher: Altium Limited; PackageDescription: Axial Device, Thru-Hole; 2 Leads; 0.4 in Pin Spacing
  R26 R*1: Value: 100kΩ
  RcompA1: Value: 15.8kΩ
  RfbbA1: Value: 69.8kΩ
  RfbtA1: Value: 220kΩ
  RlimA1: Value: 162kΩ
  RtA1: Value: 413kΩ

## Sheet eps_batt.SchDoc: Battery Protection
size A4; DrawnBy: J. Reimer T. Yeung M. Au; Organization: UTAT SS; DocumentNumber: 4; Revision: 2.0; SheetNumber: 4; SheetTotal: 17
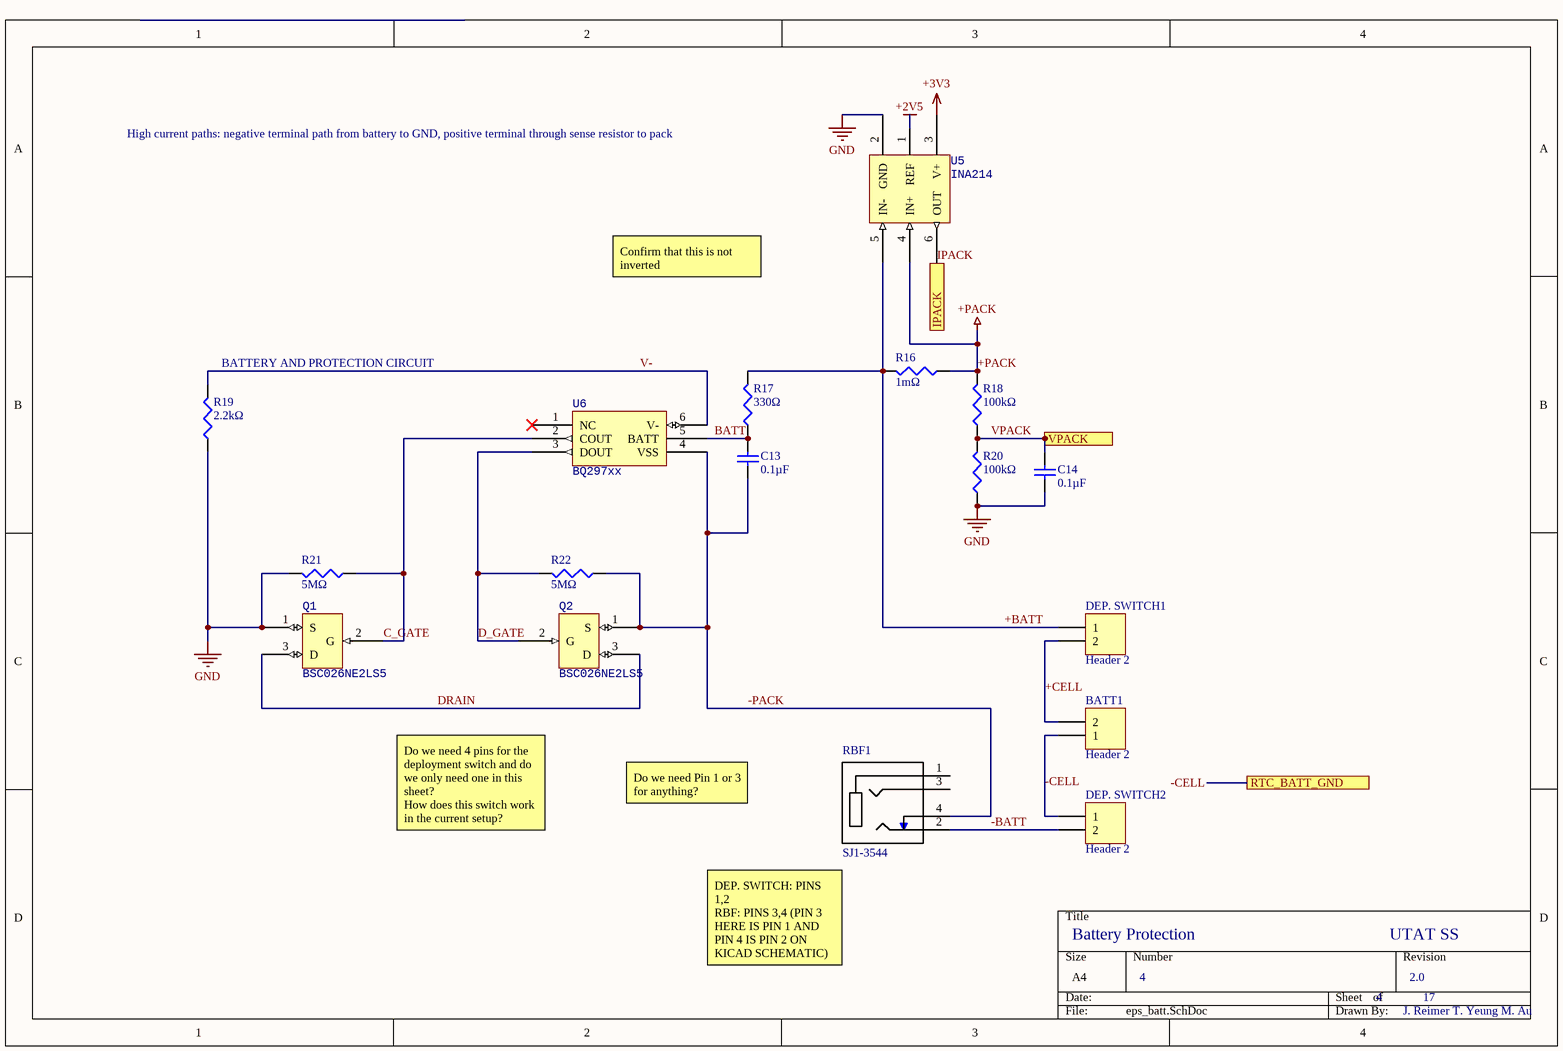
[diagram p6: eps_batt.SchDoc]

### Parts
BATT1  Header 2  [WM1351-ND]
C13  0.1µF  [1608[0603]]
C14  0.1µF  [1608[0603]]
DEP._SWITCH1  Header 2  [WM1351-ND]
DEP._SWITCH2  Header 2  [WM1351-ND]
Q1  BSC026NE2LS5  [INF-PG-TDSON-8-1_V]
Q2  BSC026NE2LS5  [INF-PG-TDSON-8-1_V]
R16  1mΩ  [C1206]
R17  330Ω  [J1-0603]
R18  100kΩ  [J1-0603]
R19  2.2kΩ  [J1-0603]
R20  100kΩ  [J1-0603]
R21  5MΩ  [J1-0603]
R22  5MΩ  [J1-0603]
RBF1  SJ1-3544  [SJ1-3544]
U5  INA214  [SOT65P210X110-6N]
U6  BQ297xx  [SON50P150X150X80-6N]

### Ports
IPACK (out), RTC_BATT_GND, VPACK (out)

### Nets
+2V5: U5.1(REF)
+3V3: U5.3(V+)
+PACK: R16.1 R18.2 U5.4(IN+)
GND: C14.1 Q1.1(S) R19.1 R20.1 R21.2 U5.2(GND)
+BATT: DEP._SWITCH1.1 R16.2 R17.2 U5.5(IN-)
+CELL: BATT1.2 DEP._SWITCH1.2
-BATT: DEP._SWITCH2.2 RBF1.2
-CELL: BATT1.1 DEP._SWITCH2.1 ; port RTC_BATT_GND
-PACK: C13.1 Q2.1(S) R22.1 RBF1.4 U6.4(VSS)
BATT: C13.2 R17.1 U6.5(BATT)
C_GATE: Q1.2(G) R21.1 U6.2(COUT)
D_GATE: Q2.2(G) R22.2 U6.3(DOUT)
DRAIN: Q1.3(D) Q2.3(D)
IPACK: C14.2 R18.1 R20.2 U5.6(OUT) ; port VPACK, port IPACK  [also labelled VPACK]
V-: R19.2 U6.6(V-)

Not connected (* = marked no-connect by the designer): RBF1 1 3; U6 1(NC)*

### Notes on the sheet
- High current paths: negative terminal path from battery to GND, positive terminal through sense resistor to pack
- Confirm that this is not inverted
- (near R19) BATTERY AND PROTECTION CIRCUIT
- Do we need Pin 1 or 3 for anything?
- Do we need 4 pins for the deployment switch and do we only need one in this sheet?
  How does this switch work in the current setup?
- DEP. SWITCH: PINS 1,2
  RBF: PINS 3,4 (PIN 3 HERE IS PIN 1 AND PIN 4 IS PIN 2 ON KICAD SCHEMATIC)

### Library data of the parts
BATT1 = Header 2: Battery Header, 2-Pin; LatestRevisionDate: 17-Jul-2002; LatestRevisionNote: Re-released for DXP Platform.; Publisher: Altium Limited; Supplier 1: Digi-Key; Supplier Part Number 1: WM1351-ND
C13 C14 = Cap Semi: Capacitor (Semiconductor SIM Model); Published: 8-Jun-2000; LatestRevisionDate: 29-May-2009; LatestRevisionNote: IPC-7351 Footprint Added.; PackageReference: C1206; Publisher: Altium Limited; PackageDescription: Chip Capacitor; Value: 0.1µF
  C13: Supplier 1: Digi-Key; Supplier Part Number 1: 311-1088-6-ND
DEP._SWITCH1 = Header 2: High-side deployment switch, 2-Pin; LatestRevisionDate: 17-Jul-2002; LatestRevisionNote: Re-released for DXP Platform.; Publisher: Altium Limited; Supplier 1: Digi-Key; Supplier Part Number 1: WM1351-ND
DEP._SWITCH2 = Header 2: Low-side deployment switch, 2-Pin; LatestRevisionDate: 17-Jul-2002; LatestRevisionNote: Re-released for DXP Platform.; Publisher: Altium Limited; Supplier 1: Digi-Key; Supplier Part Number 1: WM1351-ND
Q1 Q2 = BSC026NE2LS5: MOSFET; ComponentLink1Description: N-Channel Mosfet; ComponentLink1URL: https://www.digikey.ca/product-detail/en/infineon-technologies/BSC026NE2LS5ATMA1/BSC026NE2LS5ATMA1DKR-ND/6564538
  Q1: Supplier 1: Digi-Key; Supplier Part Number 1: BSC026NE2LS5ATMA1CT-ND
R16-R22 = Res3: Resistor; Published: 8-Jun-2000; LatestRevisionDate: 29-May-2009; LatestRevisionNote: IPC-7351 Footprint Added.; PackageReference: J1-0603; Publisher: Altium Limited; PackageDescription: Chip Resistor
  R16: Value: 1mΩ; Supplier 1: Digi-Key; Supplier Part Number 1: P.010AVDKR-ND
  R17: Value: 330Ω; Supplier 1: Digi-Key; Supplier Part Number 1: 541-330HDKR-ND
  R18: Value: 100kΩ; Supplier 1: Digi-Key; Supplier Part Number 1: 541-100KHCT-ND
  R19: Value: 2.2kΩ; Supplier 1: Digi-Key; Supplier Part Number 1: P2.20KHCT-ND
  R20: Value: 100kΩ
  R21 R22: Value: 5MΩ; Supplier 1: Digi-Key; Supplier Part Number 1: 541-330HDKR-ND
U5 = INA214: Current monitor; Supplier 1: Digi-Key; Supplier Part Number 1: 296-38956-1-ND
U6 = BQ2972: Battery protection; ComponentLink1Description: Charge Controller; ComponentLink1URL: https://www.digikey.com/product-detail/en/texas-instruments/BQ29729DSET/296-44131-1-ND/6005144; Supplier 1: Digi-Key; Supplier Part Number 1: 296-37746-6-ND
RBF1 = SJ1-3544: Value: *; Supplier 1: Digi-Key; Supplier Part Number 1: CP1-3544-ND

## Sheet bt_current_monitor.SchDoc
size A4; SheetNumber: 8; SheetTotal: 19
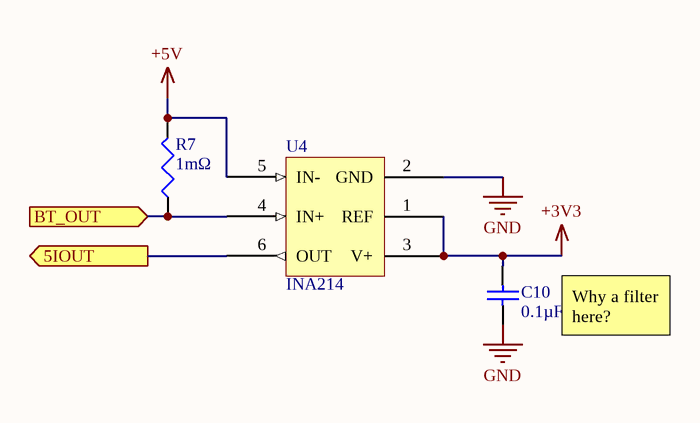
[diagram p7: bt_current_monitor.SchDoc]

### Parts
(Parts that share a designator on the sheet are numbered #1, #2 ... from top to bottom, then left to right.)
C10  0.1µF  [1608[0603]]
R7#2  1mΩ  [J1-0603]
U4  INA214  [SOT65P210X110-6N]

### Ports
5IOUT (out), BT_OUT (in)

### Nets
+3V3: C10.2 U4.1(REF) U4.3(V+)
+5V: R7#2.2 U4.5(IN-)
GND: C10.1 U4.2(GND)
5IOUT: U4.6(OUT) ; port 5IOUT
BT_OUT: R7#2.1 U4.4(IN+) ; port BT_OUT

### Notes on the sheet
- (near C10) Why a filter here?

### Library data of the parts
C10 = Cap Semi: Capacitor (Semiconductor SIM Model); Published: 8-Jun-2000; LatestRevisionDate: 29-May-2009; LatestRevisionNote: IPC-7351 Footprint Added.; PackageReference: C1206; Publisher: Altium Limited; PackageDescription: Chip Capacitor; Value: 0.1µF
R7#2 = Res3: Resistor; Published: 8-Jun-2000; LatestRevisionDate: 29-May-2009; LatestRevisionNote: IPC-7351 Footprint Added.; PackageReference: J1-0603; Publisher: Altium Limited; PackageDescription: Chip Resistor; Value: 1mΩ
U4 = INA214: Current monitor

## Sheet eps_flash.SchDoc
size A4; SheetNumber: 11; SheetTotal: 19
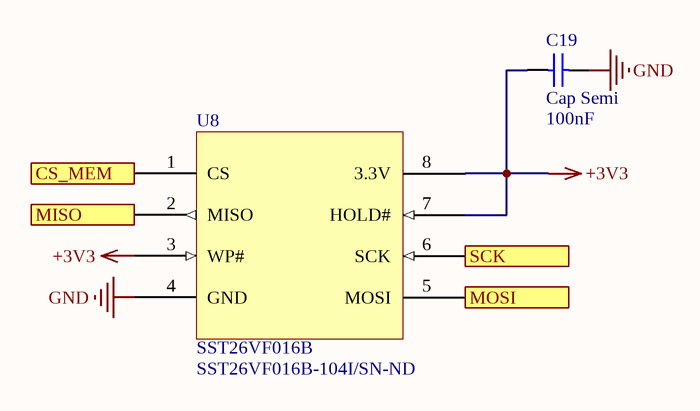
[diagram p8: eps_flash.SchDoc]

### Parts
(Parts that share a designator on the sheet are numbered #1, #2 ... from top to bottom, then left to right.)
C19  Cap Semi  value 100nF  [1608[0603]]
U8#2  SST26VF016B  Supplier Part Number 1: SST26VF016B-104I/SN-ND  [SOIC127P500X600-8N]

### Ports
CS_MEM (in), MISO (out), MOSI (in), SCK (in)

### Nets
+3V3: C19.1 U8#2.3(WP#) U8#2.7(HOLD#) U8#2.8(3.3V)
GND: C19.2 U8#2.4(GND)
CS_MEM: U8#2.1(CS) ; port CS_MEM
MISO: U8#2.2(MISO) ; port MISO
MOSI: U8#2.5(MOSI) ; port MOSI
SCK: U8#2.6(SCK) ; port SCK

### Library data of the parts
C19 = Cap Semi: Capacitor (Semiconductor SIM Model); Published: 8-Jun-2000; LatestRevisionDate: 29-May-2009; LatestRevisionNote: IPC-7351 Footprint Added.; PackageReference: C1206; Publisher: Altium Limited; PackageDescription: Chip Capacitor
U8#2 = SST26VF016B: 2.5V/3.0V 16 Mbit Serial Quad I/O (SQI) Flash Memory; ComponentLink1Description: SST25VF016B; ComponentLink1URL: https://www.digikey.ca/product-detail/en/microchip-technology/SST26VF016B-104I-SN/SST26VF016B-104I-SN-ND/5033651; Supplier 1: Digi-Key

## Nets that join several sheets
+3V3: bus-main (5 pins), eps_digital (C67.2), U_eps_bb11 (6 pins), U_eps_bb12 (6 pins), eps_pv (U7.3 U8#1.3 U9.3 U10.3), eps_batt (U5.3), bt_current_monitor (C10.2 U4.1 U4.3), eps_flash (C19.1 U8#2.3 U8#2.7 U8#2.8)
+5V: bus-main (8 pins), eps_pv (GDB1.4 GDB2.4), bt_current_monitor (R7#2.2 U4.5)
+PACK: bus-main (J1.24 PACK_IN.1), U_eps_bb11 (6 pins), U_eps_bb12 (6 pins), eps_pv (D5.3), U_eps_bt11 (BT1_U_eps_bt11.9 Cin2_U_eps_bt11.2 CinA1_U_eps_bt11.2 LA1_U_eps_bt11.1), U_eps_bt12 (BT1_U_eps_bt12.9 Cin2_U_eps_bt12.2 CinA1_U_eps_bt12.2 LA1_U_eps_bt12.1), eps_batt (R16.1 R18.2 U5.4)
GND: bus-main (19 pins), eps_digital (5 pins), U_eps_bb11 (11 pins), U_eps_bb12 (11 pins), eps_pv (22 pins), U_eps_bt11 (16 pins), U_eps_bt12 (16 pins), eps_batt (6 pins), bt_current_monitor (C10.1 U4.2), eps_flash (C19.2 U8#2.4)
+XVgs: eps_digital (R14.2), eps_pv (GDB1.3)
+YVgs: eps_digital (R12.2), eps_pv (GDB1.10)
-XVgs: eps_digital (R13.2), eps_pv (GDB1.5)
-YVgs: eps_digital (R11.2), eps_pv (GDB1.12)
BT_OUT: U_eps_bt11 (6 pins), U_eps_bt12 (6 pins), bt_current_monitor (R7#2.1 U4.4)